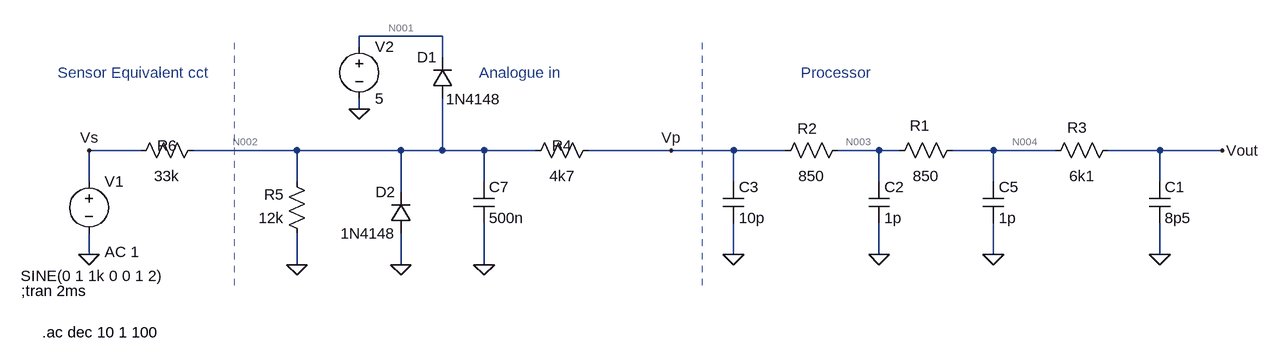
[diagram p0: schematic SPC572L_ADC_Vbat_1ms.asc]
SPC572L_ADC_Vbat_1ms.asc, the LTspice schematic file:
Version 4
SHEET 1 920 680
WIRE -352 32 -480 32
WIRE -480 48 -480 32
WIRE -352 64 -352 32
WIRE -480 144 -480 128
WIRE -816 208 -896 208
WIRE -576 208 -736 208
WIRE -416 208 -576 208
WIRE -352 208 -352 128
WIRE -352 208 -416 208
WIRE -288 208 -352 208
WIRE -208 208 -288 208
WIRE 0 208 -128 208
WIRE 96 208 0 208
WIRE 176 208 96 208
WIRE 320 208 256 208
WIRE 352 208 320 208
WIRE 496 208 432 208
WIRE 592 208 496 208
WIRE 752 208 672 208
WIRE 848 208 752 208
WIRE -896 256 -896 208
WIRE -576 256 -576 208
WIRE -288 256 -288 208
WIRE 96 256 96 208
WIRE 320 256 320 208
WIRE 496 256 496 208
WIRE 752 256 752 208
WIRE -416 272 -416 208
WIRE -896 368 -896 336
WIRE 96 368 96 320
WIRE 320 368 320 320
WIRE 496 368 496 320
WIRE 752 368 752 320
WIRE -576 384 -576 336
WIRE -416 384 -416 336
WIRE -288 384 -288 320
FLAG 320 368 0
FLAG 752 368 0
FLAG -896 368 0
FLAG 848 208 Vout
FLAG 96 368 0
FLAG 496 368 0
FLAG -288 384 0
FLAG 0 208 Vp
FLAG -896 208 Vs
FLAG -416 384 0
FLAG -480 144 0
FLAG -576 384 0
SYMBOL res 272 192 R90
WINDOW 0 -2 62 VBottom 2
WINDOW 3 40 56 VTop 2
SYMATTR InstName R2
SYMATTR Value 850
SYMBOL res 688 192 R90
WINDOW 0 -4 63 VBottom 2
WINDOW 3 40 56 VTop 2
SYMATTR InstName R3
SYMATTR Value 6k1
SYMBOL cap 736 256 R0
SYMATTR InstName C1
SYMATTR Value 8p5
SYMBOL cap 304 256 R0
SYMATTR InstName C2
SYMATTR Value 1p
SYMBOL res -112 192 R90
WINDOW 0 24 56 VBottom 2
WINDOW 3 40 56 VTop 2
SYMATTR InstName R4
SYMATTR Value 4k7
SYMBOL voltage -896 240 R0
WINDOW 123 24 124 Left 2
WINDOW 39 0 0 Left 2
WINDOW 3 -105 161 Left 2
SYMATTR Value2 AC 1
SYMATTR Value SINE(0 1 1k 0 0 1 2)
SYMATTR InstName V1
SYMBOL cap 80 256 R0
SYMATTR InstName C3
SYMATTR Value 10p
SYMBOL res 448 192 R90
WINDOW 0 -7 65 VBottom 2
WINDOW 3 40 56 VTop 2
SYMATTR InstName R1
SYMATTR Value 850
SYMBOL cap 480 256 R0
SYMATTR InstName C5
SYMATTR Value 1p
SYMBOL res -560 352 R180
WINDOW 0 36 76 Left 2
WINDOW 3 36 40 Left 2
SYMATTR InstName R5
SYMATTR Value 12k
SYMBOL res -720 192 R90
WINDOW 0 24 56 VBottom 2
WINDOW 3 40 56 VTop 2
SYMATTR InstName R6
SYMATTR Value 33k
SYMBOL cap -304 256 R0
SYMATTR InstName C7
SYMATTR Value 500n
SYMBOL diode -336 128 R180
WINDOW 0 24 64 Left 2
WINDOW 3 -74 -1 Left 2
SYMATTR InstName D1
SYMATTR Value 1N4148
SYMBOL diode -400 336 R180
WINDOW 0 24 64 Left 2
WINDOW 3 24 0 Left 2
SYMATTR InstName D2
SYMATTR Value 1N4148
SYMBOL voltage -480 32 R0
WINDOW 123 0 0 Left 2
WINDOW 39 0 0 Left 2
SYMATTR InstName V2
SYMATTR Value 5
TEXT -296 88 Left 2 ;Analogue in
TEXT 200 88 Left 2 ;Processor
TEXT -1000 424 Left 2 !;tran 2ms
TEXT -944 88 Left 2 ;Sensor Equivalent cct
TEXT -968 488 Left 2 !.ac dec 10 1 100
LINE Normal 48 416 48 32 2
LINE Normal -672 416 -672 32 2

The netlist it stands for:
* SPC572L_ADC_Vbat_1ms.asc
R2 N003 Vp 850
R3 Vout N004 6k1
C1 Vout 0 8p5
C2 N003 0 1p
R4 Vp N002 4k7
V1 Vs 0 SINE(0 1 1k 0 0 1 2) AC 1
C3 Vp 0 10p
R1 N004 N003 850
C5 N004 0 1p
R5 0 N002 12k
R6 N002 Vs 33k
C7 N002 0 500n
D1 N002 N001 1N4148
D2 0 N002 1N4148
V2 N001 0 5
.model D D
.lib standard.dio
* Analogue in
* Processor
;tran 2ms
* Sensor Equivalent cct
.ac dec 10 1 100
.backanno
.end

* Results of the author's LTspice run, read from the files saved beside the schematic
* Operating Point, zero values left out:
*   V(n003) = 4.674 mV
*   V(vp) = 4.674 mV
*   V(vout) = 4.674 mV
*   V(n004) = 4.674 mV
*   V(n002) = 4.674 mV
*   V(vs) = 17.45 mV
*   V(n001) = 5 V
*   I(D2) = -247 pA
*   I(D1) = -2.525 nA
*   I(R6) = -387.2 nA
*   I(R5) = -389.5 nA
*   I(V2) = -2.525 nA
*   I(V1) = -387.2 nA
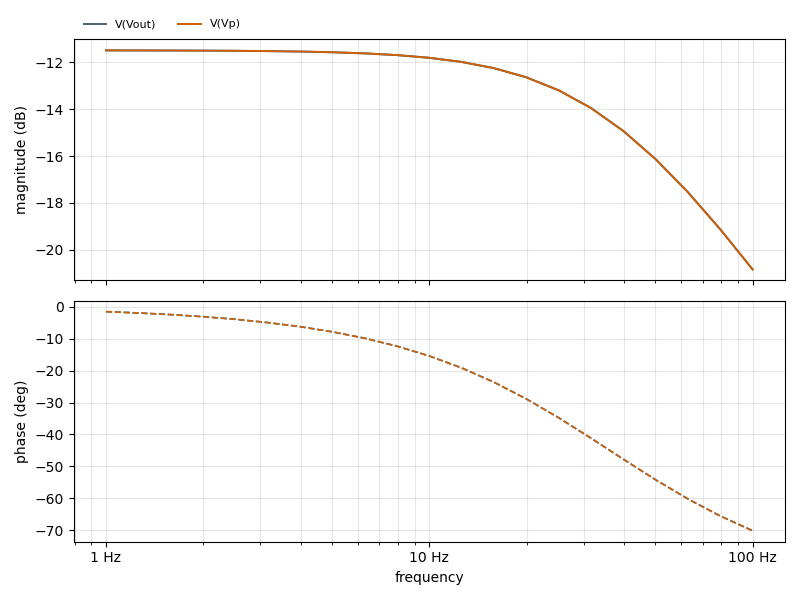
[diagram p1: AC Analysis of SPC572L_ADC_Vbat_1ms.asc, plotted from the saved traces]
* AC Analysis, 1 run:
*   V(Vout): -11.49 dB at 1 Hz, -20.85 dB at 100 Hz, peak -11.49 dB at 1 Hz, 3 dB below the peak at 35.98 Hz
*   V(Vp): -11.49 dB at 1 Hz, -20.85 dB at 100 Hz, peak -11.49 dB at 1 Hz, 3 dB below the peak at 35.98 Hz